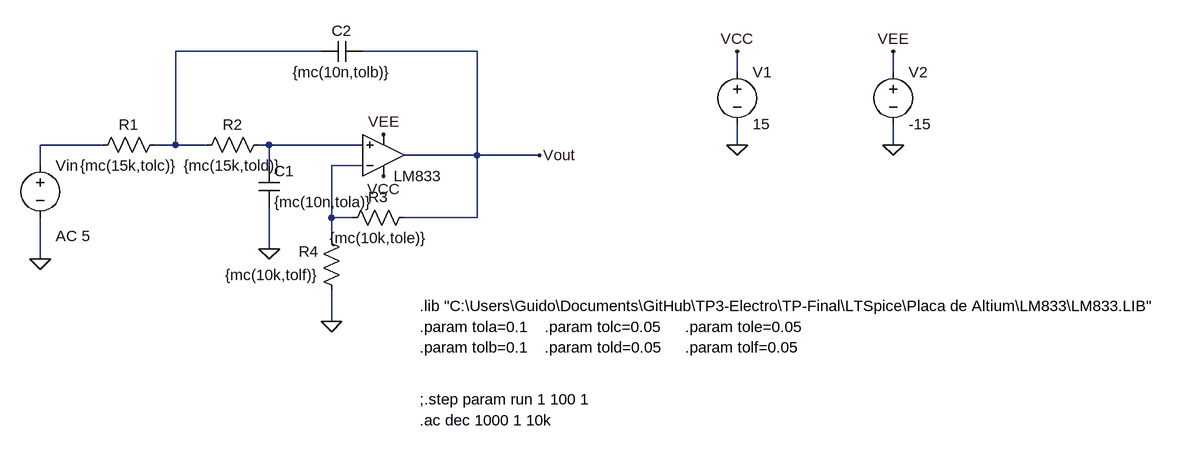
[diagram p0: schematic Altium.asc]
Altium.asc, the LTspice schematic file:
Version 4
SHEET 1 1516 680
WIRE 176 -208 -48 -208
WIRE 416 -208 240 -208
WIRE 816 -176 816 -208
WIRE 1056 -176 1056 -208
WIRE -160 -64 -256 -64
WIRE -48 -64 -48 -208
WIRE -48 -64 -80 -64
WIRE 0 -64 -48 -64
WIRE 96 -64 80 -64
WIRE 240 -64 96 -64
WIRE 816 -64 816 -96
WIRE 1056 -64 1056 -96
WIRE 416 -48 416 -208
WIRE 416 -48 304 -48
WIRE 512 -48 416 -48
WIRE -256 -32 -256 -64
WIRE 96 -32 96 -64
WIRE 240 -32 192 -32
WIRE 192 48 192 -32
WIRE 224 48 192 48
WIRE 416 48 416 -48
WIRE 416 48 304 48
WIRE 192 80 192 48
WIRE 96 96 96 32
WIRE -256 112 -256 48
WIRE 192 208 192 160
FLAG 96 96 0
FLAG 192 208 0
FLAG 512 -48 Vout
FLAG -256 112 0
FLAG 816 -208 VCC
FLAG 816 -64 0
FLAG 272 -16 VCC
FLAG 272 -80 VEE
FLAG 1056 -208 VEE
FLAG 1056 -64 0
SYMBOL Opamps\\UniversalOpamp2 272 -48 M180
SYMATTR InstName LM833
SYMBOL res -64 -80 R90
WINDOW 0 0 56 VBottom 2
WINDOW 3 32 56 VTop 2
SYMATTR InstName R1
SYMATTR Value {mc(15k,tolc)}
SYMBOL res 96 -80 R90
WINDOW 0 0 56 VBottom 2
WINDOW 3 32 56 VTop 2
SYMATTR InstName R2
SYMATTR Value {mc(15k,told)}
SYMBOL res 320 32 R90
WINDOW 0 0 56 VBottom 2
WINDOW 3 32 56 VTop 2
SYMATTR InstName R3
SYMATTR Value {mc(10k,tole)}
SYMBOL res 208 176 R180
WINDOW 0 36 76 Left 2
WINDOW 3 36 40 Left 2
SYMATTR InstName R4
SYMATTR Value {mc(10k,tolf)}
SYMBOL cap 80 -32 R0
SYMATTR InstName C1
SYMATTR Value {mc(10n,tola)}
SYMBOL cap 240 -224 R90
WINDOW 0 0 32 VBottom 2
WINDOW 3 32 32 VTop 2
SYMATTR InstName C2
SYMATTR Value {mc(10n,tolb)}
SYMBOL voltage -256 -48 R0
WINDOW 123 24 124 Left 2
WINDOW 39 0 0 Left 0
SYMATTR Value2 AC 5
SYMATTR InstName Vin
SYMATTR Value ""
SYMBOL voltage 816 -192 R0
WINDOW 123 0 0 Left 0
WINDOW 39 0 0 Left 0
SYMATTR InstName V1
SYMATTR Value 15
SYMBOL voltage 1056 -192 R0
WINDOW 123 0 0 Left 0
WINDOW 39 0 0 Left 0
SYMATTR InstName V2
SYMATTR Value -15
TEXT 328 184 Left 2 !.lib "C:\\Users\\Guido\\Documents\\GitHub\\TP3-Electro\\TP-Final\\LTSpice\\Placa de Altium\\LM833\\LM833.LIB"
TEXT 328 216 Left 2 !.param tola=0.1
TEXT 328 248 Left 2 !.param tolb=0.1
TEXT 328 328 Left 2 !;.step param run 1 100 1
TEXT 520 216 Left 2 !.param tolc=0.05
TEXT 520 248 Left 2 !.param told=0.05
TEXT 736 216 Left 2 !.param tole=0.05
TEXT 736 248 Left 2 !.param tolf=0.05
TEXT 328 360 Left 2 !.ac dec 1000 1 10k

The netlist it stands for:
* Altium.asc
XLM833 N003 N004 VCC VEE Vout level.2 Avol=1Meg GBW=10Meg Slew=10Meg ilimit=25m rail=0 Vos=0 phimargin=45 en=0 enk=0 in=0 ink=0 Rin=500Meg  ; pins IN+ IN- V+ V- OUT
R1 N001 N002 {mc(15k,tolc)}
R2 N003 N001 {mc(15k,told)}
R3 Vout N004 {mc(10k,tole)}
R4 0 N004 {mc(10k,tolf)}
C1 N003 0 {mc(10n,tola)}
C2 Vout N001 {mc(10n,tolb)}
Vin N002 0 AC 5
V1 VCC 0 15
V2 VEE 0 -15
.lib "C:\Users\Guido\Documents\GitHub\TP3-Electro\TP-Final\LTSpice\Placa de Altium\LM833\LM833.LIB"
.param tola=0.1
.param tolb=0.1
;.step param run 1 100 1
.param tolc=0.05
.param told=0.05
.param tole=0.05
.param tolf=0.05
.ac dec 1000 1 10k
.lib UniversalOpamps2.sub
.backanno
.end